# Altium project PCB_NAPaC_Project1.PrjPCB
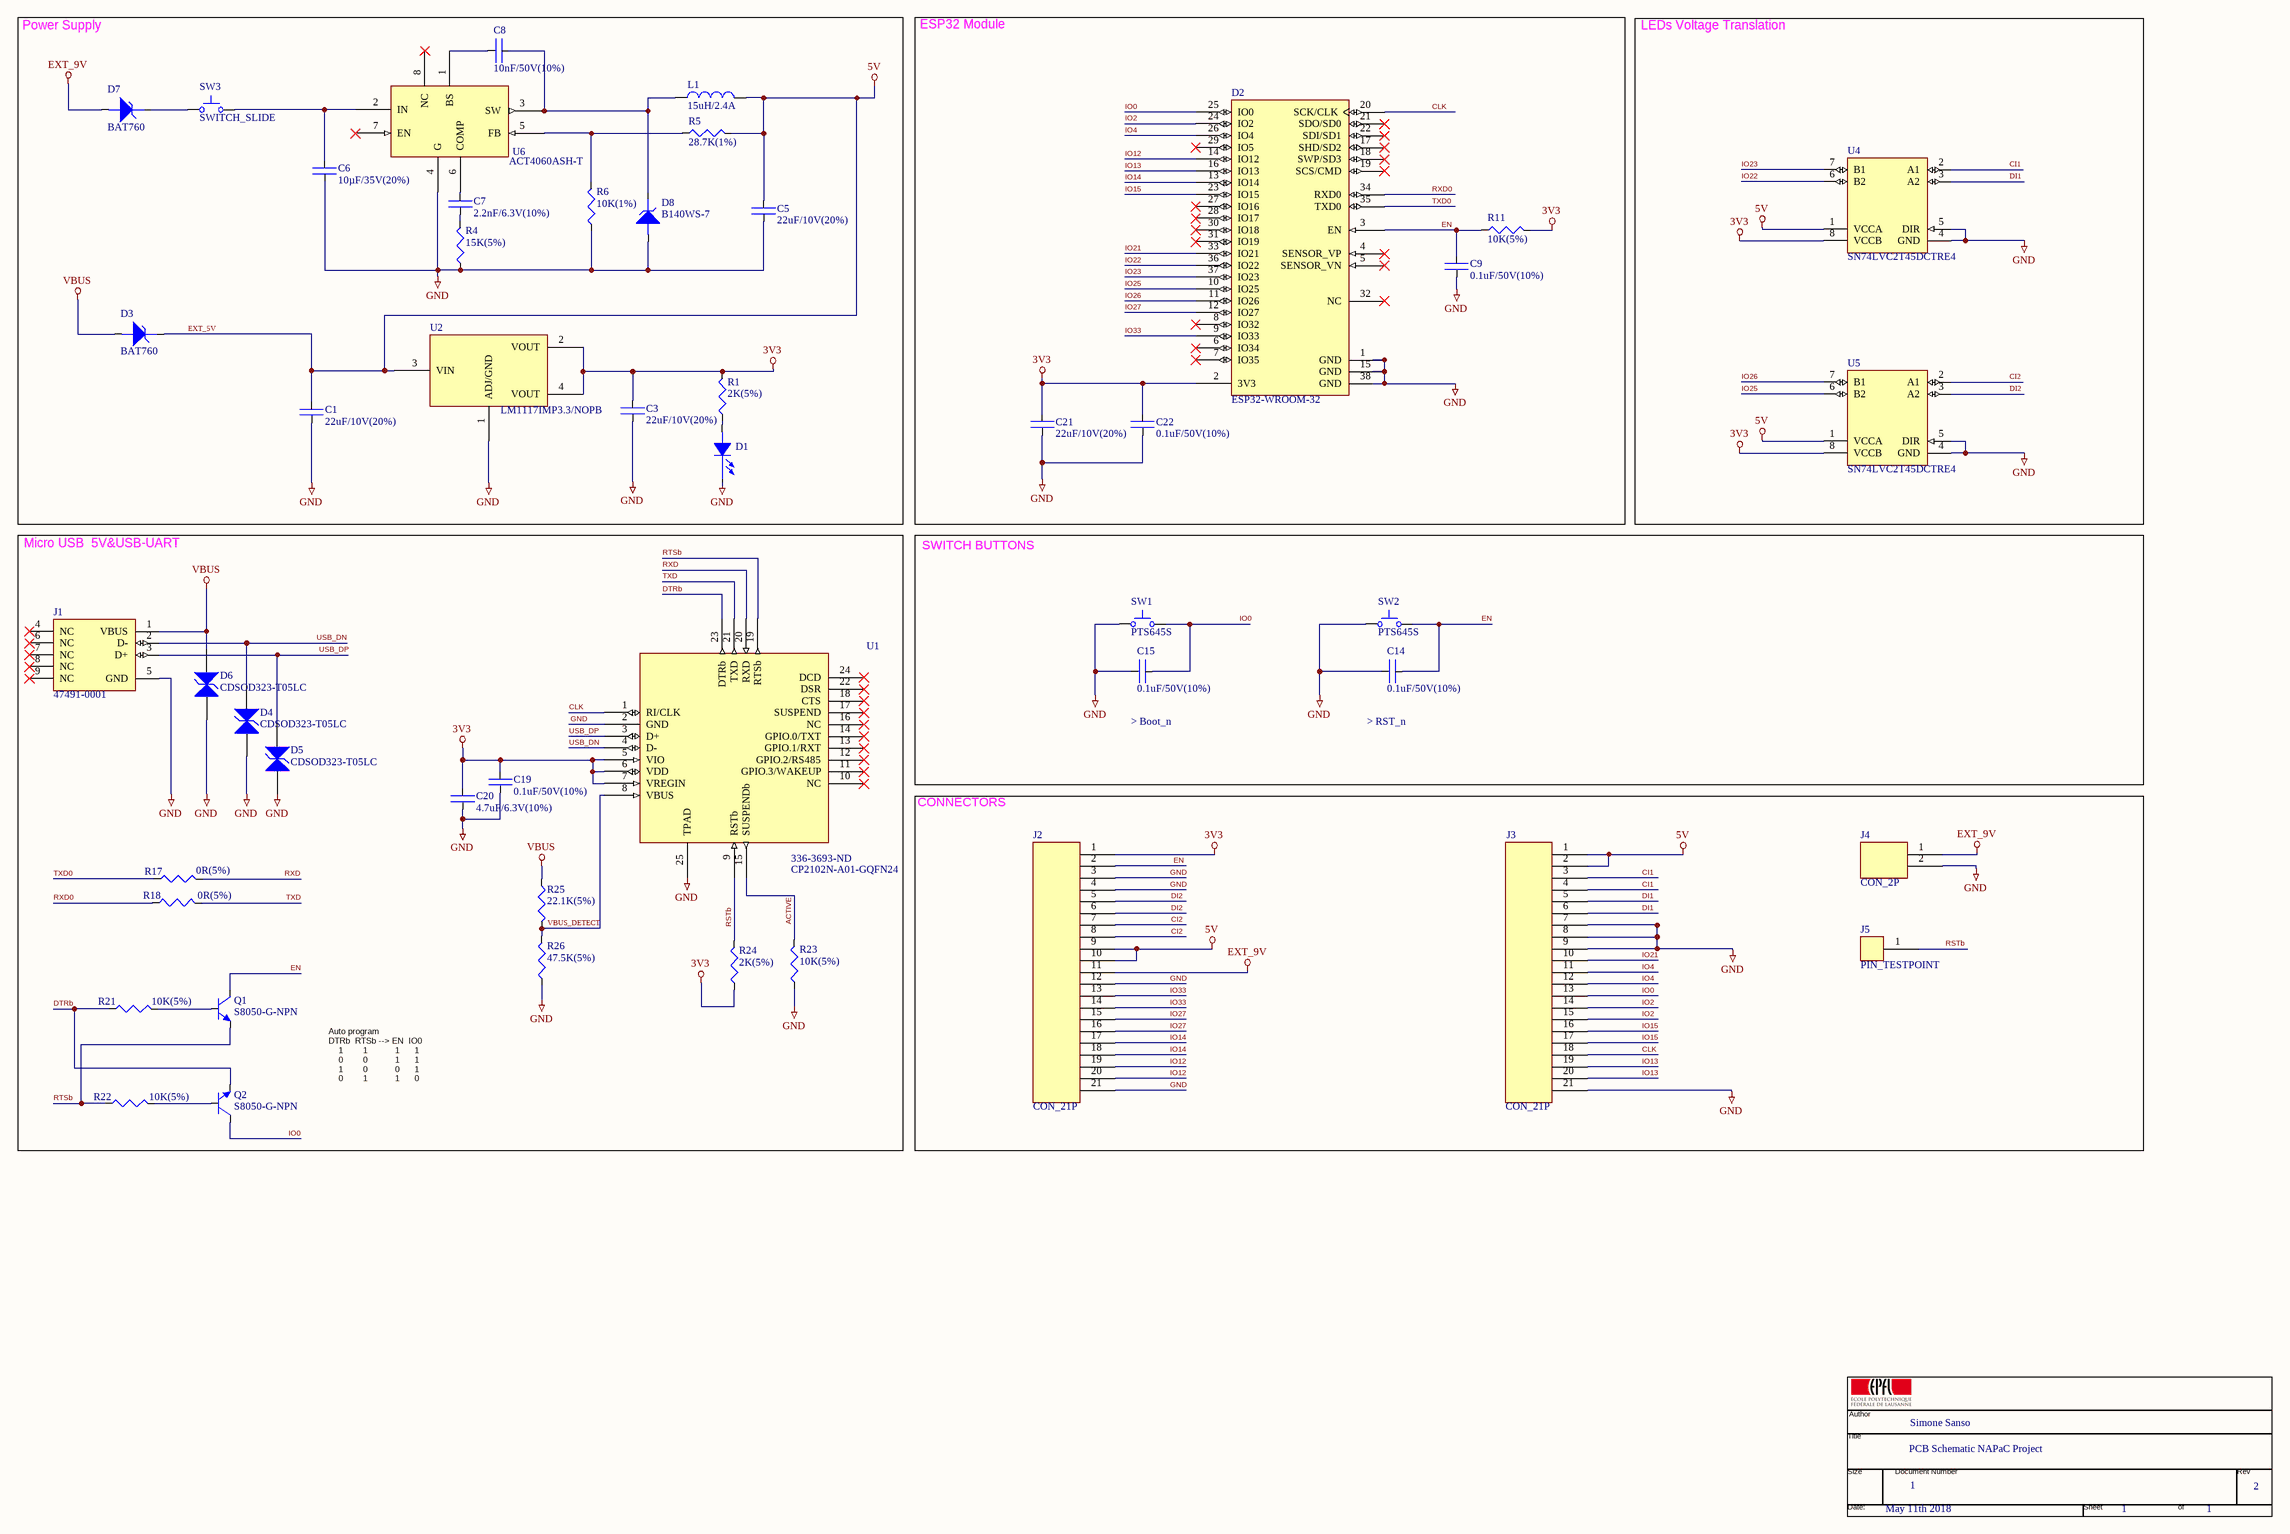
[diagram p0: NAPaC.SchDoc]
1 sheet, 51 parts. Net scope: global (net labels, ports and power ports of the same name join across sheets).
Board file: NAPaC_PCB1.PcbDoc

## Sheet NAPaC.SchDoc
size 513 x 386 mm

### Parts
*  TITLE_BLOCK  (value not drawn)
C1  22uF/10V(20%)  [CAPC0603]
C3  22uF/10V(20%)  [CAPC0603]
C5  22uF/10V(20%)  [CAPC0603]
C6  10µF/35V(20%)  [CAPC0603]
C7  2.2nF/6.3V(10%)  [CAPC0603]
C8  10nF/50V(10%)  [CAPC0603]
C9  0.1uF/50V(10%)  [CAPC0603]
C14  0.1uF/50V(10%)  [CAPC0603]
C15  0.1uF/50V(10%)  [CAPC0603]
C19  0.1uF/50V(10%)  [CAPC0603]
C20  4.7uF/6.3V(10%)  [CAPC0603]
C21  22uF/10V(20%)  [CAPC0603]
C22  0.1uF/50V(10%)  [CAPC0603]
D1  SML-D12U1WT86  [SML-D12U1WT86]  (value not drawn)
D2  ESP32-WROOM-32  [OLMX-ESP-WROOM-32]
D3  BAT760  [SOD-323]
D4  CDSOD323-T05LC  [SOD-323]
D5  CDSOD323-T05LC  [SOD-323]
D6  CDSOD323-T05LC  [SOD-323]
D7  BAT760  [SOD-323]
D8  B140WS-7  [SOD-323-SCHOTTKY_DIODE-40V/1A]
J1  47491-0001  [USB-MICRO-B_V]
J2  CON_21P  [PINS_HEADER-21]
J3  CON_21P  [PINS_HEADER-21]
J4  CON_2P  [PINS_ALIM-2]
J5  PIN_TESTPOINT  [PIN_TESTPOINT]
L1  15uH/2.4A  [NRS8040-SELF-15uH/2.4A]
Q1  S8050-G-NPN  [SOT23]
Q2  S8050-G-NPN
R1  2K(5%)  [RC0402]
R4  15K(5%)  [RC0402]
R5  28.7K(1%)  [RC0402]
R6  10K(1%)  [RC0402]
R11  10K(5%)  [RC0402]
R17  0R(5%)  [RC0402]
R18  0R(5%)  [RC0402]
R21  10K(5%)  [RC0402]
R22  10K(5%)  [RC0402]
R23  10K(5%)  [RC0402]
R24  2K(5%)  [RC0402]
R25  22.1K(5%)  [RC0402]
R26  47.5K(5%)  [RC0402]
SW1  PTS645S  [CKCP-PTS645S_V]
SW2  PTS645S  [CKCP-PTS645S_V]
SW3  SWITCH_SLIDE  [SW_SLIDE]
U1  CP2102N-A01-GQFN24  Supplier Part Number 1: 336-3693-ND  [CP2102N-GQFN24]
U2  LM1117IMP3.3/NOPB  [LM1117]
U4  SN74LVC2T45DCTRE4  [VOLTAGE_TRANSLATOR_3.3-5V]
U5  SN74LVC2T45DCTRE4  [VOLTAGE_TRANSLATOR_3.3-5V]
U6  ACT4060ASH-T  [SWITCHING_VOLTAGE_REGULATOR]

### Blocks framed on the sheet
Power Supply: C1 C3 C5-C8 D1 D3 D7 D8 L1 R1 R4-R6 SW3 U2 U6
ESP32 Module: C9 C21 C22 D2 R11
LEDs Voltage Translation: U4 U5
Micro USB  5V&USB-UART: C19 C20 D4-D6 J1 Q1 Q2 R17 R18 R21-R26 U1
SWITCH BUTTONS: C14 C15 SW1 SW2
CONNECTORS: J2-J5

### Nets
3V3: C3.2 C19.2 C20.2 C21.2 C22.2 D2.2(3V3) J2.1 R1.2 R11.2 R24.1 U1.5(VIO) U1.6(VDD) U1.7(VREGIN) U2.2(VOUT) U2.4(VOUT) U4.8(VCCB) U5.8(VCCB)
EXT_5V: C1.2 C5.2 D3.2(K) J2.9 J2.10 J3.1 J3.2 L1.2 R5.2 U2.3(VIN) U4.1(VCCA) U5.1(VCCA)  [also labelled 5V]
EXT_9V: D7.1(A) J2.11 J4.1(VIN)
GND: C1.1 C3.1 C5.1 C6.1 C9.1 C14.1 C15.1 C19.1 C20.1 C21.1 C22.1 D1.2 D2.1(GND) D2.15(GND) D2.38(GND) D4.1(C) D5.1(C) D6.1(C) D8.1(A) J1.5(GND) J2.3 J2.4 J2.12 J2.21 J3.7 J3.8 J3.9 J3.21 J4.2(GND) R4.1 R6.1 R23.1 R26.1 SW1.1 SW2.1 U1.2(GND) U1.25(TPAD) U2.1(ADJ/GND) U4.4(GND) U4.5(DIR) U5.4(GND) U5.5(DIR) U6.4(G)
VBUS: D3.1(A) D6.2(C) J1.1(VBUS) R25.1
ACTIVE: R23.2 U1.15(SUSPENDb)
CI1: J3.3 J3.4 U4.2(A1)
CI2: J2.7 J2.8 U5.2(A1)
CLK: D2.20(SCK/CLK) J3.18 U1.1(RI/CLK)
DI1: J3.5 J3.6 U4.3(A2)
DI2: J2.5 J2.6 U5.3(A2)
DTRb: Q2.2(EMITTER) R21.1 U1.23(DTRb)
EN: C9.2 C14.2 D2.3(EN) J2.2 Q1.3(COLLECTOR) R11.1 SW2.2
IO0: C15.2 D2.25(IO0) J3.13 Q2.3(COLLECTOR) SW1.2
IO2: D2.24(IO2) J3.14 J3.15
IO4: D2.26(IO4) J3.11 J3.12
IO12: D2.14(IO12) J2.19 J2.20
IO13: D2.16(IO13) J3.19 J3.20
IO14: D2.13(IO14) J2.17 J2.18
IO15: D2.23(IO15) J3.16 J3.17
IO21: D2.33(IO21) J3.10
IO22: D2.36(IO22) U4.6(B2)
IO23: D2.37(IO23) U4.7(B1)
IO25: D2.10(IO25) U5.6(B2)
IO26: D2.11(IO26) U5.7(B1)
IO27: D2.12(IO27) J2.15 J2.16
IO33: D2.9(IO33) J2.13 J2.14
RSTb: J5.1(Testpoint) R24.2 U1.9(RSTb)
RTSb: Q1.2(EMITTER) R22.1 U1.19(RTSb)
RXD: R17.2 U1.20(RXD)
RXD0: D2.34(RXD0) R18.1
TXD: R18.2 U1.21(TXD)
TXD0: D2.35(TXD0) R17.1
USB_DN: D4.2(C) J1.2(D-) U1.4(D-)
USB_DP: D5.2(C) J1.3(D+) U1.3(D+)
VBUS_DETECT: R25.2 R26.2 U1.8(VBUS)
NetC6_2: C6.2 SW3.2 U6.2(IN)
NetC7_1: C7.1 R4.2
NetC7_2: C7.2 U6.6(COMP)
NetC8_1: C8.1 U6.1(BS)
NetC8_2: C8.2 D8.2(K) L1.1 U6.3(SW)
NetD1_1: D1.1 R1.1
NetD7_2: D7.2(K) SW3.1
NetQ1_1: Q1.1(BASE) R21.2
NetQ2_1: Q2.1(BASE) R22.2
NetR5_1: R5.1 R6.2 U6.5(FB)

Not connected (* = marked no-connect by the designer): D2 4(SENSOR_VP)* 5(SENSOR_VN)* 6(IO34)* 7(IO35)* 8(IO32)* 17(SHD/SD2)* 18(SWP/SD3)* 19(SCS/CMD)* 21(SDO/SD0)* 22(SDI/SD1)* 27(IO16)* 28(IO17)* 29(IO5)* 30(IO18)* 31(IO19)* 32(NC)*; J1 4(NC)* 6(NC)* 7(NC)* 8(NC)* 9(NC)*; U1 10(NC)* 11(GPIO.3/WAKEUP)* 12(GPIO.2/RS485)* 13(GPIO.1/RXT)* 14(GPIO.0/TXT)* 16(NC)* 17(SUSPEND)* 18(CTS)* 22(DSR)* 24(DCD)*; U6 7(EN)* 8(NC)*

### Notes on the sheet
- (near C15) > Boot_n
- (near C14) > RST_n
- Auto program
  DTRb  RTSb --> EN  IO0
  1        1           1      1
  0        0           1      1
  1        0           0      1
  0        1           1      0
- (in symbol TITLE_BLOCK) Author; Simone Sanso; Title; PCB Schematic NAPaC Project; Size; Document Number; Rev; 1; 2; Date:; May 11th 2018; Sheet; of

### Library data of the parts
C1 C3 C5 C21 = CAP-22uF/10V(20%): GRM188R61A226ME15D-22uF/10V(20%); Supplier 1: Digi-Key; Supplier Part Number 1: 490-10476-6-ND
C6 = CAP-10µF/35V(20%): C0603C106M8PACTU; Supplier 1: Mouser; Supplier Part Number 1: 80-C0603C106M8PACTU
C7 = CAP-2.2nF/6.3V(10%): C0603X7R0J222K030BA; Supplier 1: Mouser; Supplier Part Number 1: 810-C0603X7R0J222K0A
C8 = CAP-10nF/50V(10%): C1608X7R1H103K080AE; Supplier 1: Mouser; Supplier Part Number 1: 810-C1608X7R1H103KAE
C9 C14 C15 C19 C22 = CAP-0.1uF/50V(10%): GRM188R71H104KA93D-0.1uF/50V(10%); Supplier 1: Distrelec; Supplier Part Number 1: 16520001
C20 = CAP-0.4uF/6.3V(10%): GRT188C80J475KE01D; Supplier 1: Mouser; Supplier Part Number 1: 81-GRT188C80J475KE1D
D1 = RED_LED: SML-D12U1WT86-2.2V-20mA; Supplier 1: Mouser; Supplier Part Number 1: 755-SML-D12U1WT86
D2 = ESP-WROOM-32: Supplier 1: Mouser; Supplier Part Number 1: 356-ESP-WROOM-32
D3 D7 = SchottkyDiode: BAT760-7-Schottky Diodes & Rectifiers 0.5A 30V LF; Supplier 1: Avnet; Supplier Part Number 1: BAT760-7/BKN
D4-D6 = BidirectionalDiode: Supplier 1: Mouser; Supplier Part Number 1: 652-CDSOD323-T05LC
D8 = SCHOTTKY_DIODE-40V/3A: Diode Schottky 40V 1A 2-Pin SOD-323 T/R; Supplier 1: Mouser; Supplier Part Number 1: 621-B140WS-7
J1 = USB_CON8: USB Connectors MICRO USB B RECPT MIDDLE MNT ASSY; Supplier 1: Distrelec; Supplier Part Number 1: 30076400
J2 J3 = PINS_HEADER: 21 Positions Header, Breakaway Connector 0.100" (2.54mm) Through Hole Tin; Supplier 1: Digi-Key; Supplier Part Number 1: S1012EC-21-ND
J4 = PIN_ALIM: 2 Positions Header, Breakaway Connector 0.100" (2.54mm) Through Hole Tin
J5 = PIN_TESTPOINT: 1 Position Header, Breakaway Connector 0.100" (2.54mm) Through Hole Tin
L1 = SELF-15uH/2.4A: NRS8040T150MJGJ; Supplier 1: Mouser; Supplier Part Number 1: 963-NRS8040T150MJGJ
Q1 = SS8050-G-NPN: 750-SS8050-G-BJT NPN SOT-23-3 TRANSISTOR 1.5A 40V; Supplier 1: Mouser; Supplier Part Number 1: 750-SS8050-G
Q2 = SS8050-G-NPNbis: 750-SS8050-G-BJT NPN SOT-23-3 TRANSISTOR 1.5A 40V
R1 R24 = RESISTOR-2K(5%): RC0402JR-072KL; Supplier 1: Newark; Supplier Part Number 1: 67R9979
R4 = RESISTOR-15K(5%): RC0402JR-0715KL; Supplier 1: Newark; Supplier Part Number 1: 67R9973
R5 = RESISTOR-28.7K(1%): RC0402JR-072K7L; Supplier 1: Newark; Supplier Part Number 1: 67R9981
R6 = RESISTOR-10K(1%): RC0402F103CS; Supplier 1: Digi-Key; Supplier Part Number 1: 1276-3530-6-ND
R11 R21-R23 = RESISTOR-10K(5%): RC0402JR-0710KL; Supplier 1: Newark; Supplier Part Number 1: 67R9964
R17 R18 = RESISTOR-0R(5%): RC0402JR-070RL; Supplier 1: Newark; Supplier Part Number 1: 67R9963
R25 = RESISTOR-22.1K(5%): RC0402FR-0722K1L; Supplier 1: Arrow; Supplier Part Number 1: RC0402FR-0722K1L**MULT1
R26 = RESISTOR-47.5K(5%): RC0402FR-0747K5L; Supplier 1: Future Electronics; Supplier Part Number 1: 2781938
SW1 SW2 = SW: PTS645SL432LFS; Supplier 1: Avnet; Supplier Part Number 1: PTS645SL432LFS
SW3 = SWITCH_SLIDE: 48ASSP1S1M6QBT; Supplier 1: Distrelec; Supplier Part Number 1: 11087397
U1 = CP2102N-GQFN24: Supplier 1: Digi-Key
U2 = LM1117-3.3: Supplier 1: Distrelec; Supplier Part Number 1: 173-06-781
U4 U5 = VOLTAGE_TRANSLATOR_3.3-5V: Translation - Voltage Levels DUAL-BIT DUAL SUPPLY TRANSCEIVER; Supplier 1: Farnell; Supplier Part Number 1: 9592768
U6 = SWITCHING_VOLTAGE_REGULATOR: Supplier 1: Mouser; Supplier Part Number 1: 107-ACT4060ASH-T